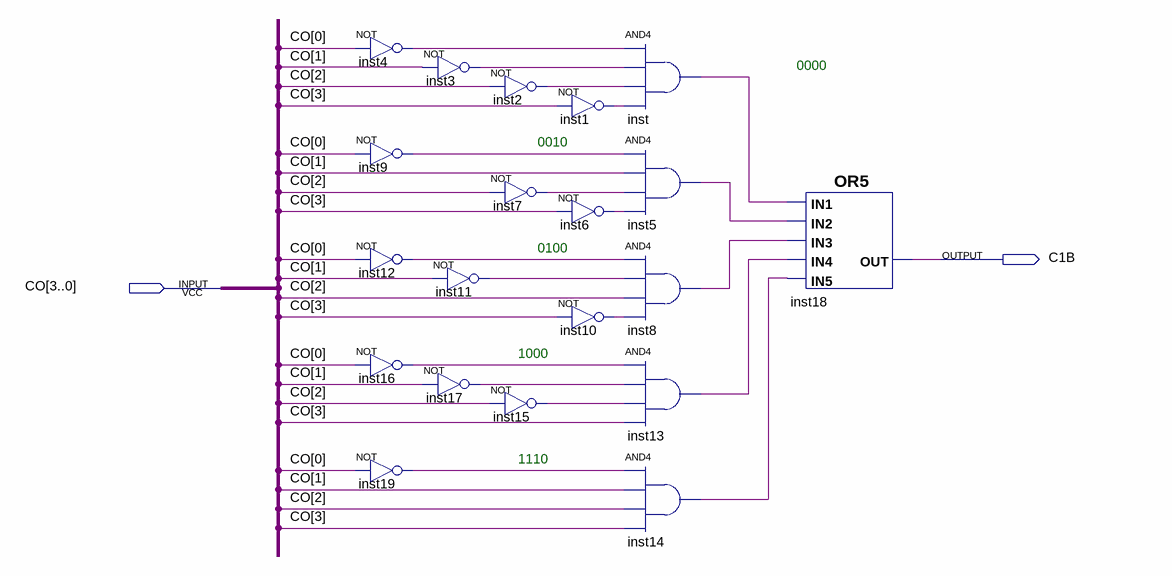
[diagram p0: schematic sheet]
// Quartus schematic FlagFormUnit.bdf as structural Verilog: 20 symbols, 2 pins
module FlagFormUnit (
  input  [3:0] CO,
  output C1B
);

  wire inst1_out, inst2_out, inst3_out, inst4_out, inst5_out, inst6_out, inst7_out, inst8_out, inst9_out,
       inst10_out, inst11_out, inst12_out, inst13_out, inst14_out, inst15_out, inst16_out, inst17_out,
       inst19_out, inst_out;

  not inst4 (inst4_out, CO[0]);
  not inst9 (inst9_out, CO[0]);
  not inst12 (inst12_out, CO[0]);
  not inst16 (inst16_out, CO[0]);
  not inst19 (inst19_out, CO[0]);
  not inst3 (inst3_out, CO[1]);
  not inst11 (inst11_out, CO[1]);
  not inst17 (inst17_out, CO[1]);
  not inst2 (inst2_out, CO[2]);
  not inst7 (inst7_out, CO[2]);
  not inst15 (inst15_out, CO[2]);
  and inst (inst_out, inst4_out, inst3_out, inst2_out, inst1_out);
  not inst1 (inst1_out, CO[3]);
  and inst5 (inst5_out, inst9_out, CO[1], inst7_out, inst6_out);
  not inst6 (inst6_out, CO[3]);
  and inst8 (inst8_out, inst12_out, inst11_out, CO[2], inst10_out);
  not inst10 (inst10_out, CO[3]);
  and inst13 (inst13_out, inst16_out, inst17_out, inst15_out, CO[3]);
  and inst14 (inst14_out, inst19_out, CO[1], CO[2], CO[3]);
  or inst18 (C1B, inst_out, inst5_out, inst8_out, inst13_out, inst14_out);

  // Notes on the sheet:
  //   0000
  //   0010
  //   0100
  //   1000
  //   1110
endmodule
